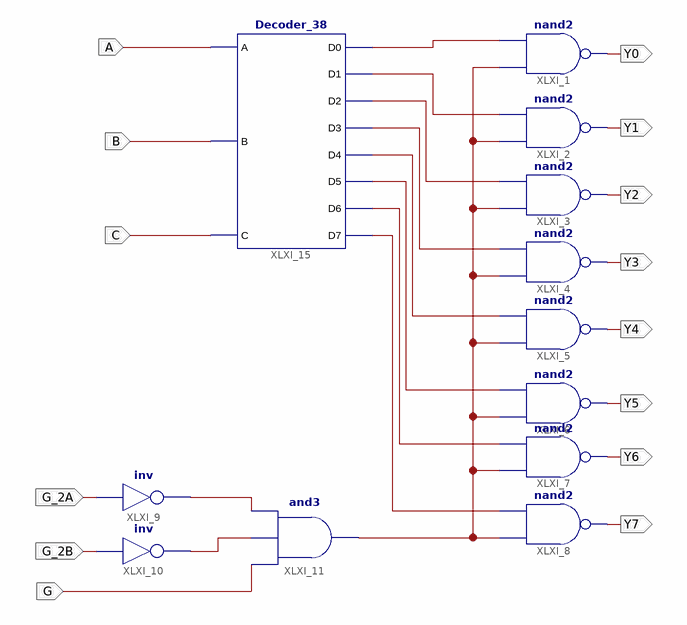
[diagram p0: schematic sheet 1]
// Xilinx ISE schematic HCT138.sch (kintex7) as structural Verilog: 12 symbols, 14 ports
module HCT138 (
  input  A,
  input  B,
  input  C,
  input  G,
  input  G_2A,
  input  G_2B,
  output Y0,
  output Y1,
  output Y2,
  output Y3,
  output Y4,
  output Y5,
  output Y6,
  output Y7
);

  wire XLXN_4, XLXN_5, XLXN_6, XLXN_7, XLXN_8, XLXN_9, XLXN_10, XLXN_11, XLXN_12, XLXN_13, XLXN_16;

  nand XLXI_1 (Y0, XLXN_16, XLXN_4);
  nand XLXI_2 (Y1, XLXN_16, XLXN_5);
  nand XLXI_3 (Y2, XLXN_16, XLXN_6);
  nand XLXI_4 (Y3, XLXN_16, XLXN_7);
  nand XLXI_5 (Y4, XLXN_16, XLXN_8);
  nand XLXI_6 (Y5, XLXN_16, XLXN_9);
  nand XLXI_7 (Y6, XLXN_16, XLXN_10);
  nand XLXI_8 (Y7, XLXN_16, XLXN_11);
  not XLXI_9 (XLXN_12, G_2A);
  not XLXI_10 (XLXN_13, G_2B);
  and XLXI_11 (XLXN_16, G, XLXN_13, XLXN_12);
  Decoder_38 XLXI_15 (
    .A(A), .B(B), .C(C), .D0(XLXN_4), .D1(XLXN_5), .D2(XLXN_6), .D3(XLXN_7), .D4(XLXN_8), .D5(XLXN_9),
    .D6(XLXN_10), .D7(XLXN_11));
endmodule
